# EAGLE design 9-Dof_Sensor_Card (EAGLE 6.4)

## Sheet 1 of 2
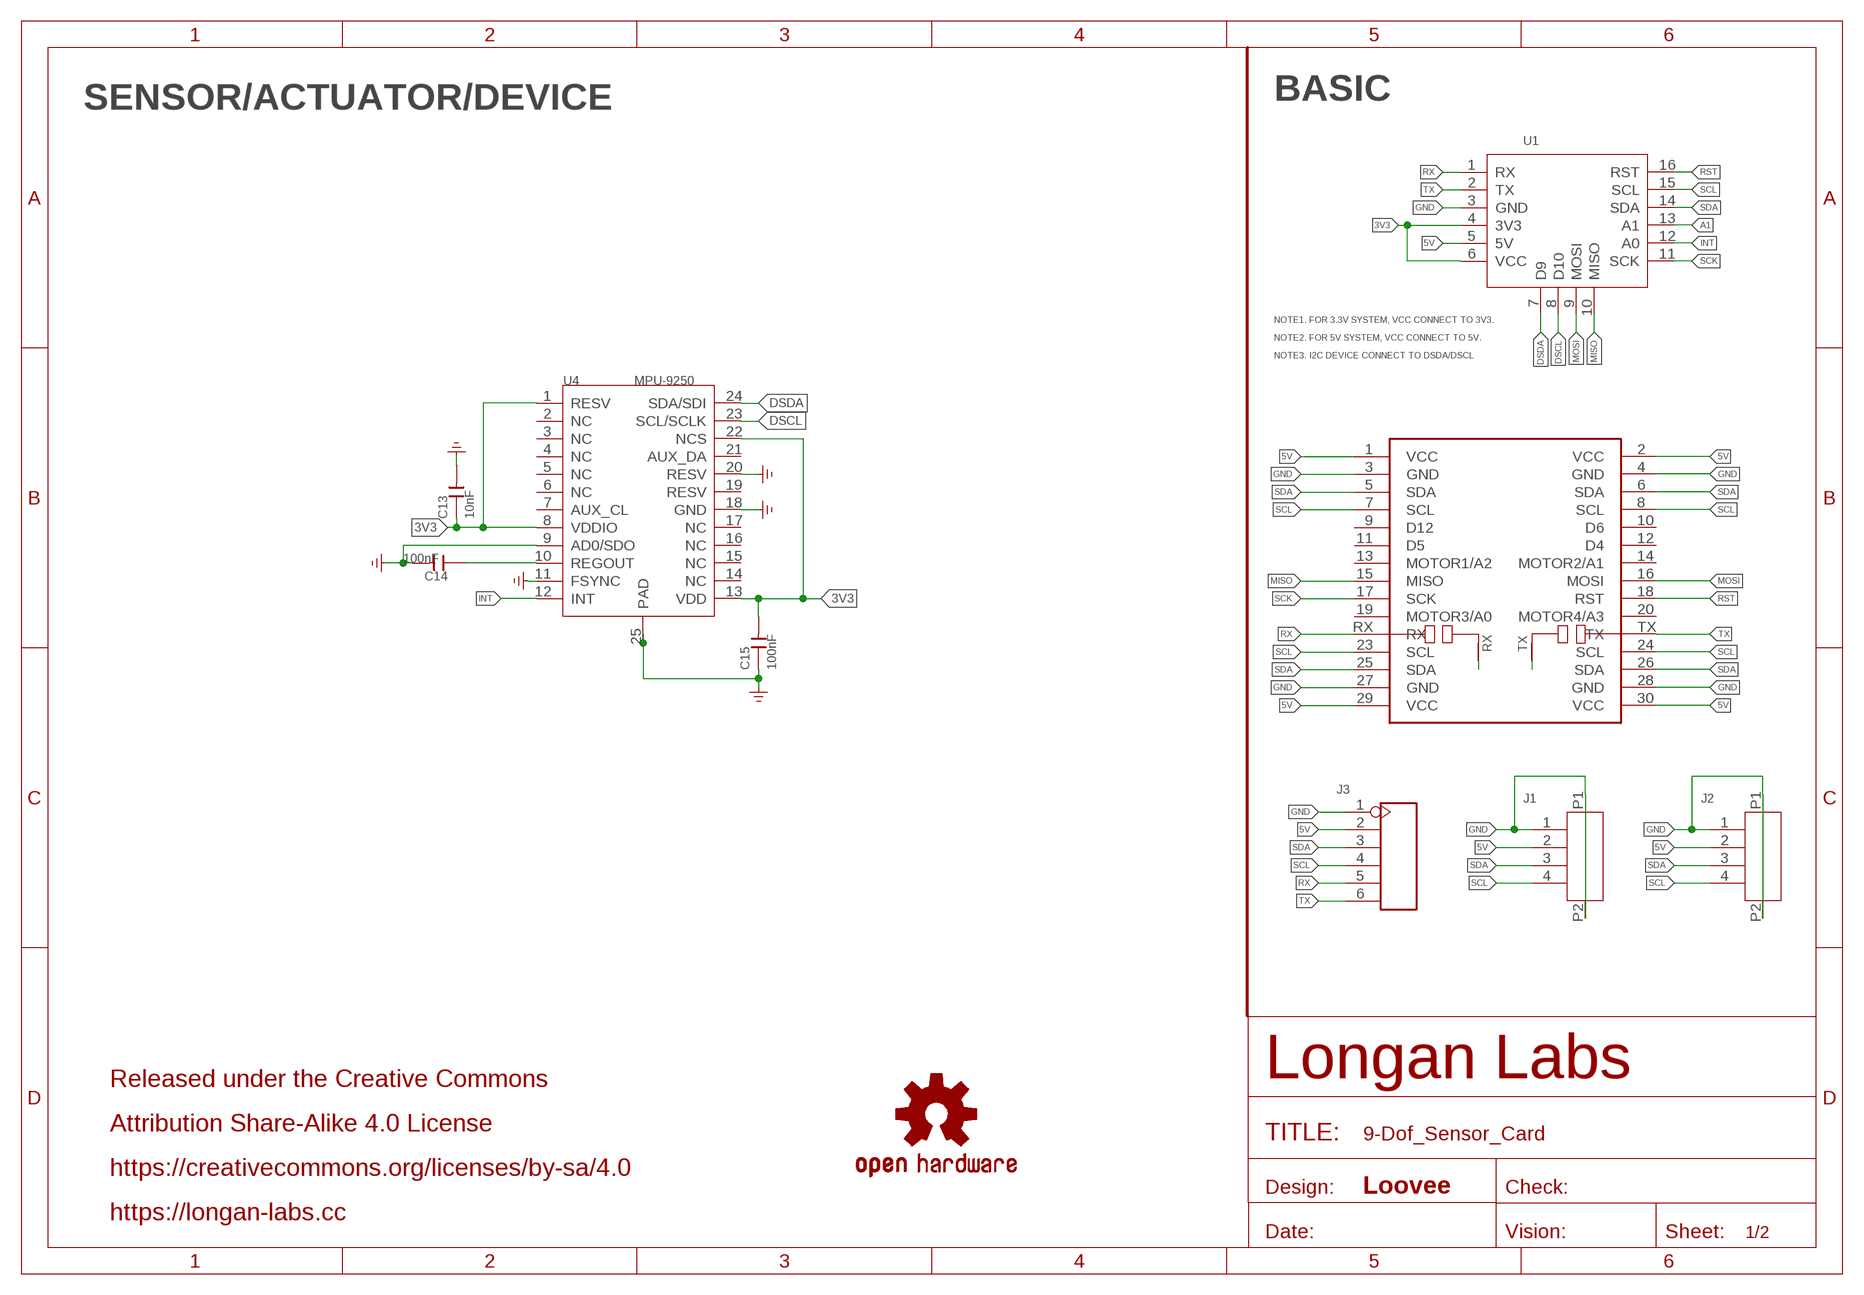
[diagram p0: schematic, sheet 1]

### Parts
C13  10nF  CAP-0603  [C0603]
C14  100nF  CAP-0603  [C0603]
C15  100nF  CAP-0603  [C0603]
J1  HEADER-4P-1.0  [4P-1.0-90D]
J2  HEADER-4P-1.0  [4P-1.0-90D]
J3  HEADER-6P-55/35MIL  [H6-2.54]
LOGO2  OSHW-LOGOS  [OSHW-LOGO-S]
MOUDLE2  MOUDLE-CARDS-UART'BOARD'  [MOUDLE-2X15P-UART]
U1  MOUDLE-CARDS  [16P-2.0-CARDS]
U4  MPU-9250  [LEAD-QFN24]

### Nets
3V3: C13.1 C15.2 U1.4(3V3) U1.6(VCC) U4.1(RESV) U4.8(VDDIO) U4.13(VDD) U4.22(NCS)
5V: J1.2 J2.2 J3.2 MOUDLE2.1(VCC) MOUDLE2.2(VCC) MOUDLE2.29(VCC) MOUDLE2.30(VCC) U1.5(5V)
A1: U1.13(A1)
DSCL: U1.8(D10) U4.23(SCL/SCLK)
DSDA: U1.7(D9) U4.24(SDA/SDI)
GND: C13.2 C14.2 C15.1 J1.1 J1.P1 J1.P2 J2.1 J2.P1 J2.P2 J3.1 MOUDLE2.3(GND) MOUDLE2.4(GND) MOUDLE2.27(GND) MOUDLE2.28(GND) U1.3(GND) U4.9(AD0/SDO) U4.11(FSYNC) U4.18(GND) U4.20(RESV) U4.25(PAD) ; supply symbol labelled GND_POWER
INT: U1.12(A0) U4.12(INT)
MISO: MOUDLE2.15(MISO) U1.10(MISO)
MOSI: MOUDLE2.16(MOSI) U1.9(MOSI)
N$1: C14.1 U4.10(REGOUT)
N$2: MOUDLE2.RX/N1(RX/N) MOUDLE2.RX/N2(RX/N)
N$3: MOUDLE2.TX/N1(TX/N) MOUDLE2.TX/N2(TX/N)
RST: MOUDLE2.18(RST) U1.16(RST)
RX: J3.5 MOUDLE2.RX U1.1(RX)
SCK: MOUDLE2.17(SCK) U1.11(SCK)
SCL: J1.4 J2.4 J3.4 MOUDLE2.7(SCL) MOUDLE2.8(SCL) MOUDLE2.23(SCL) MOUDLE2.24(SCL) U1.15(SCL)
SDA: J1.3 J2.3 J3.3 MOUDLE2.5(SDA) MOUDLE2.6(SDA) MOUDLE2.25(SDA) MOUDLE2.26(SDA) U1.14(SDA)
TX: J3.6 MOUDLE2.TX U1.2(TX)
Unconnected: MOUDLE2.9(D12) MOUDLE2.10(D6) MOUDLE2.11(D5) MOUDLE2.12(D4) MOUDLE2.13(MOTOR1/A2) MOUDLE2.14(MOTOR2/A1) MOUDLE2.19(MOTOR3/A0) MOUDLE2.20(MOTOR4/A3) U4.2(NC) U4.3(NC) U4.4(NC) U4.5(NC) U4.6(NC) U4.7(AUX_CL) U4.14(NC) U4.15(NC) U4.16(NC) U4.17(NC) U4.19(RESV) U4.21(AUX_DA)

### Notes on the sheet
- SENSOR/ACTUATOR/DEVICE | BASIC
- NOTE1. FOR 3.3V SYSTEM, VCC CONNECT TO 3V3.
- NOTE2. FOR 5V SYSTEM, VCC CONNECT TO 5V.
- NOTE3. I2C DEVICE CONNECT TO DSDA/DSCL
- Released under the Creative Commons
- Attribution Share-Alike 4.0 License
- https://creativecommons.org/licenses/by-sa/4.0
- Loovee
- https://longan-labs.cc

## Sheet 2 of 2

## Library data of the parts
C13-C15 = Discrete-new:CAP: Ceramic Capacitors
J1 J2 = Longan-Connect:HEADER-4P-1.0
J3 = Connector-new:HEADER-6P
LOGO2 = SparkFun-Aesthetics:OSHW-LOGO: Open-Source Hardware (OSHW) Logo This logo indicates the piece of hardware it is found on incorporates a OSHW license and/or adheres to the definition of open source hardware found here: http://freedomdefined.org/OSHW
MOUDLE2 = Longan-moudle:MOUDLE-CARDS-UART
U1 = MOUDLE-CARDS:MOUDLE-CARDS
U4 = template:MPU-9250

## Board
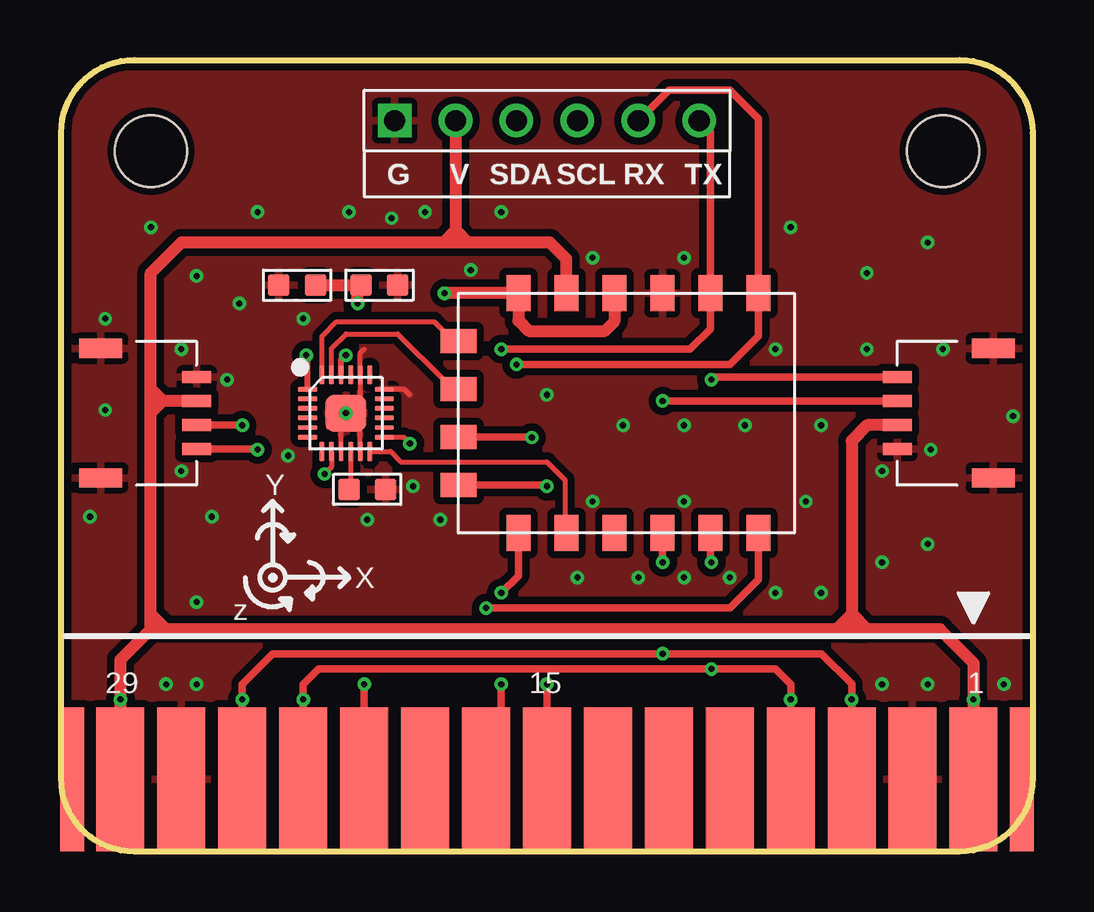
[diagram p1: board, top side]
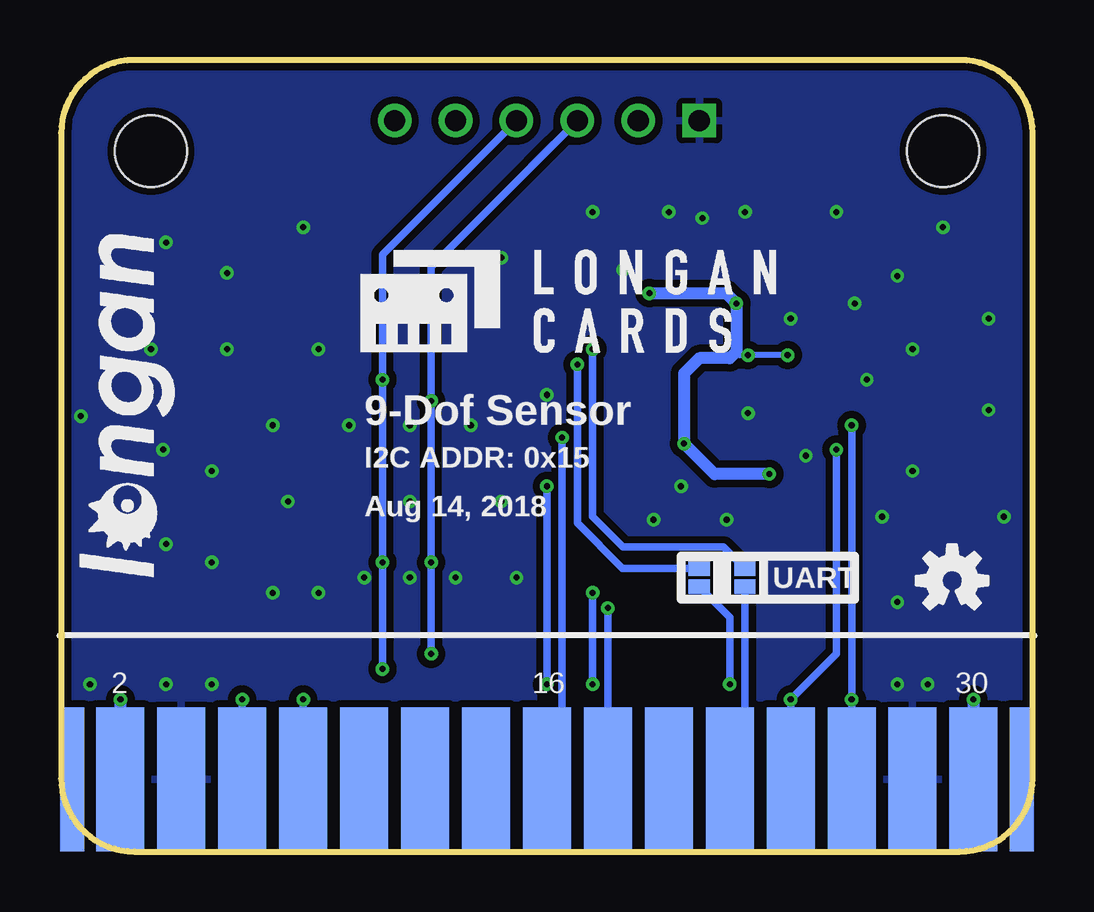
[diagram p2: board, bottom side, seen from below]

Size 40.5 x 33 mm. Coordinates in mm from the lower left corner, seen from the top.
Copper layers (1*16): Top 0.035mm / dielectric 1.5mm / Bottom 0.035mm
Design rules "SeeedStudio_2layer_DRU_no_angle_20140221 *": minimum track width 6mil, minimum drill 10mil, track to track 6mil, track to pad 6mil, pad to pad 6mil, via to via 6mil, smd to smd 0mil, copper to edge 10mil, drill to drill 10mil, minimum pad ring 10mil, minimum via ring 6mil, stop-mask expansion 2mil, vias tented up to drill 25mil, thermal gap 10mil

### Footprints (pad centres in the part's own frame; a part is rotated, then mirrored left to right if it is on the bottom)
C0603 = smd 0.889 x 0.889: 1 0,0.762; 2 0,-0.762
4P-1.0-90D = smd 1.2 x 0.5: 1 0,1.5; 2 0,0.5; 3 0,-0.5; 4 0,-1.5 | smd 1.8 x 0.8: P1 -4,2.7; P2 -4,-2.7
H6-2.54 = drill 0.889 pad 1.397 square: 1 0,6.35 | drill 0.889 pad 1.397: 2 0,3.81; 3 0,1.27; 4 0,-1.27; 5 0,-3.81; 6 0,-6.35
MOUDLE-2X15P-UART = smd 2 x 6: 1 17.78,-13.492; 3 15.24,-13.492; 5 12.7,-13.492; 7 10.16,-13.492; 9 7.62,-13.492; 11 5.08,-13.492; 13 2.54,-13.492; 15 0,-13.492; 17 -2.54,-13.492; 19 -5.08,-13.492; 23 -10.16,-13.492; 25 -12.7,-13.492; 27 -15.24,-13.492; 29 -17.78,-13.492; RX/N2 -7.62,-13.492 | smd 2 x 6 bottom: 2 17.78,-13.492; 4 15.24,-13.492; 6 12.7,-13.492; 8 10.16,-13.492; 10 7.62,-13.492; 12 5.08,-13.492; 14 2.54,-13.492; 16 0,-13.492; 18 -2.54,-13.492; 20 -5.08,-13.492; 24 -10.16,-13.492; 26 -12.7,-13.492; 28 -15.24,-13.492; 30 -17.78,-13.492; TX/N2 -7.62,-13.492 | smd 1 x 6: P1 -19.8,-13.492; P4 19.8,-13.492 | smd 1 x 6 bottom: P2 -19.8,-13.492; P3 19.8,-13.492 | smd 0.889 x 0.61 bottom: RX -6.35,-4.699; RX/N1 -6.35,-5.461; TX -8.255,-4.699; TX/N1 -8.255,-5.461 | hole 3: -16.51,12.7; 16.51,12.7
16P-2.0-CARDS = smd 1.5 x 1: 1 -5,5; 2 -5,3; 3 -5,1; 4 -5,-1; 5 -5,-3; 6 -5,-5; 11 5,-5; 12 5,-3; 13 5,-1; 14 5,1; 15 5,3; 16 5,5 | smd 1 x 1.5: 7 -3,-7.5; 8 -1,-7.5; 9 1,-7.5; 10 3,-7.5
LEAD-QFN24 = smd 0.8 x 0.2: 1 -1.6,1; 2 -1.6,0.6; 3 -1.6,0.2; 4 -1.6,-0.2; 5 -1.6,-0.6; 6 -1.6,-1; 13 1.6,-1; 14 1.6,-0.6; 15 1.6,-0.2; 16 1.6,0.2; 17 1.6,0.6; 18 1.6,1 | smd 0.2 x 0.8: 7 -1,-1.6; 8 -0.6,-1.6; 9 -0.2,-1.6; 10 0.2,-1.6; 11 0.6,-1.6; 12 1,-1.6; 19 1,1.6; 20 0.6,1.6; 21 0.2,1.6; 22 -0.2,1.6; 23 -0.6,1.6; 24 -1,1.6 | smd 1.7 x 1.54: 25 0,0

### Placement (x,y rotation side)
C13  13.27,23.61 90 top
C14  12.76,15.1 90 top
C15  9.84,23.61 90 top
J1  5.64,18.28 0 top
J2  34.86,18.28 180 top
J3  20.25,30.47 90 top
LOGO2  3.36,11.29 0 bottom
MOUDLE2  20.25,16.5 0 top
U1  24.06,18.28 270 top
U4  11.87,18.28 0 top
U$1  [LONGAN-CARDS-MIDDLE]  28.76,20.31 0 bottom
U$2  [LONGAN-SILK-SMALLER]  34.6,10.15 90 bottom

### Tracks (layer width: path | path; a pad name or v marks a point on that pad's centre or on a via)
3V3  (via drill 0.25 pad 0.51)
  Top 0.203: U4.13 14.27,17.28 v14.54,17.01 | U4.8 11.27,16.03 v10.98,15.74
  Top 0.254: U4.22 11.67,20.49 v11.87,20.69 | U4.1 10.27,20.64 v10.22,20.69
  Top 0.508: U1.4 23.06,22.1 22.66,21.71 19.49,21.71 19.06,22.13 U1.6 v15.98,23.28 | C15.2 C13.1 12.36,23.47 v12.36,22.85
  Bottom 0.254: 12.36,20.83 12.22,20.69 v11.87,20.69 v10.22,20.69
  Bottom 0.508: v15.98,23.28 12.79,23.28 v12.36,22.85 12.36,20.83 12.63,20.56 13.9,20.56 14.54,19.93 v14.54,17.01 13.27,15.74 v10.98,15.74
5V  (via drill 0.25 pad 0.51)
  Top 0.508: 33.59,9.26 36.63,9.26 38.03,7.86 v38.03,6.34 MOUDLE2.2 | 32.82,9.26 32.31,9.26 | 32.31,9.26 4.38,9.26 | 4.38,9.26 3.74,9.26 | 3.74,9.26 2.47,7.99 v2.47,6.34 MOUDLE2.30 | 3.74,9.26 3.74,9.9 | 3.74,9.9 3.74,18.28 | 3.74,18.28 3.74,18.79 | J1.2 4.26,18.78 | 4.24,18.78 3.75,18.78 3.74,18.79 | U1.5 21.06,24.71 20.38,25.39 16.95,25.39 | 16.95,25.39 16.44,25.39 | 16.44,25.39 15.93,25.39 | 15.93,25.39 5.01,25.39 3.74,24.12 3.74,19.29 | 3.74,18.79 3.74,19.29 | J3.2 16.44,25.9 | 16.44,25.9 16.44,25.39 | J2.2 33.59,17.78 32.95,17.14 32.95,9.9 | 32.95,9.9 32.95,9.39 32.82,9.26 | 4.26,18.78 3.74,19.29 | 4.26,18.78 4.24,18.78 | 4.24,18.78 3.74,18.28 | 16.44,25.9 16.95,25.39 | 16.44,25.9 15.93,25.39 | 32.95,9.9 33.59,9.26 | 32.95,9.9 32.31,9.26 | 32.82,9.26 33.59,9.26 | 4.38,9.26 3.74,9.9
  Bottom 0.508: v2.47,6.34 MOUDLE2.30 | v38.03,6.34 MOUDLE2.2
DSCL
  Top 0.203: U4.23 11.27,20.98 11.87,21.58 14.03,21.58 15.93,19.68 16.16,19.68 U1.8
DSDA
  Top 0.203: U4.24 10.87,21.47 11.49,22.09 15.55,22.09 16.06,21.58 16.26,21.58 U1.7
GND  (via drill 0.25 pad 0.51)
  Top 0.203: 11.14,17.68 11.23,17.77 11.23,18.15 | U4.9 11.67,18.08 U4.25 | U4.11 12.47,17.68 U4.25 | 12.47,18.88 U4.25 | U4.18 14.3,19.28 14.54,19.04 | 12.63,20.95 12.47,20.78 U4.20 12.47,18.19 12.5,18.15
  other vias: 4.38,6.97 5.64,6.97 34.22,6.97 36.12,6.97 21.52,11.42 24.06,11.42 25.96,11.42 27.87,11.42 29.77,10.79 31.68,10.79 39.68,18.15 36.25,16.75 36.76,20.95 31.68,17.77 28.51,17.77 25.96,17.77 23.43,17.77 25.96,14.6 22.16,14.6 31.05,14.6 20.25,19.04 17.07,24.25 5.01,20.95 5.01,15.87 1.84,18.41 1.84,22.21 1.2,13.96 6.28,13.96 5.64,23.99 3.74,26.02 8.19,26.66 15.17,26.66 11.99,26.66 18.34,26.66 22.16,24.76 25.96,24.76 29.77,20.95 33.59,20.95 30.41,26.02 36.12,25.39 33.59,24.12 34.22,12.05 36.12,12.82 34.22,15.87 39.3,6.97 12.76,13.83 5.64,10.4 13.77,26.41 7.42,22.85 11.87,18.28 15.8,13.83 6.91,19.68 9.46,16.5 14.66,15.23 10.09,22.21
  pour Bottom (isolate 0.305): -0.07,33.01 40.57,33.01 40.57,-0.01 -0.07,-0.01
  pour Top (isolate 0.305): -0.07,33.01 40.57,33.01 40.57,-0.01 -0.07,-0.01
INT
  Top 0.203: U4.12 13.72,16.68 14.15,16.25 20.25,16.25 21.01,15.48 21.01,13.33 U1.12
MISO  (via drill 0.25 pad 0.51)
  Top 0.305: U1.10 20.2,15.28 v20.25,15.23 | v20.25,6.97 MOUDLE2.15
  Bottom 0.305: v20.25,15.23 v20.25,6.97
MOSI  (via drill 0.25 pad 0.51)
  Top 0.305: U1.9 19.6,17.28 v19.61,17.26
  Bottom 0.305: v19.61,17.26 19.61,3.64 MOUDLE2.16
N$1
  Top 0.203: U4.10 12.07,15.18
  Top 0.305: 12.07,15.18 C14.1
N$2  (via drill 0.25 pad 0.51)
  Top 0.305: MOUDLE2.RX/N2 v12.63,6.97
  Bottom 0.305: v12.63,6.97 12.63,9.77 MOUDLE2.RX/N1
N$3
  Bottom 0.305: MOUDLE2.TX/N1 11.99,3.64 MOUDLE2.TX/N2
RST  (via drill 0.25 pad 0.51)
  Top 0.305: U1.16 29.06,11.34 27.87,10.15 v17.71,10.15
  Bottom 0.305: v17.71,10.15 17.71,3.93 17.96,3.67 17.96,2.78 17.58,2.4 17.58,2.88 MOUDLE2.18
RX  (via drill 0.25 pad 0.51)
  Top 0.305: J3.5 25.33,31.74 27.87,31.74 29.06,30.55 U1.1 29.06,21.5 27.87,20.31 v18.98,20.31
  Bottom 0.305: MOUDLE2.RX 17.09,11.8 18.98,13.69 v18.98,20.31
SCK  (via drill 0.25 pad 0.51)
  Top 0.305: U1.11 19.06,11.5 v18.34,10.79 | v18.34,6.97 18.34,3.64 MOUDLE2.17
  Bottom 0.305: v18.34,10.79 v18.34,6.97
SCL  (via drill 0.25 pad 0.51)
  Top 0.305: U1.15 27.06,12.1 v27.11,12.05 | J1.4 8.16,16.78 v8.19,16.75 | J2.4 27.21,19.78 v27.11,19.68 | MOUDLE2.23 v10.09,6.34 10.09,6.97 10.72,7.61 v27.11,7.61 29.77,7.61 30.41,6.97 v30.41,6.34 MOUDLE2.8 | MOUDLE2.23 10.09,2.53 10.22,2.4 10.22,2.88 MOUDLE2.23
  Bottom 0.305: v27.11,7.61 v27.11,12.05 v27.11,19.68 27.11,24.88 J3.4 | v8.19,16.75 8.19,8.24 v10.09,6.34 MOUDLE2.23 | v30.41,6.34 MOUDLE2.8
SDA  (via drill 0.25 pad 0.51)
  Top 0.305: U1.14 25.06,12.07 v25.08,12.05 | J1.3 v7.54,17.78 v7.55,17.77 | J2.3 25.08,18.78 v25.08,18.79 | MOUDLE2.25 7.42,3.13 7.42,3.55 7.55,3.67 v7.55,6.34 7.55,6.97 8.82,8.24 v25.08,8.24 31.69,8.24 32.95,6.99 v32.95,6.34 MOUDLE2.6
  Bottom 0.305: v25.08,8.24 v25.08,12.05 v25.08,18.79 25.08,24.37 J3.3 20.89,28.56 | v7.55,17.77 v7.55,6.34 MOUDLE2.25 | v32.95,6.34 MOUDLE2.6
TX  (via drill 0.25 pad 0.51)
  Top 0.305: J3.6 27.06,30.01 U1.2 27.06,21.79 26.22,20.95 v18.34,20.95
  Bottom 0.305: v18.34,20.95 18.34,13.96 17.07,12.69 12.88,12.69 MOUDLE2.TX

### Text on the board
tPlace: G | V | SDA | SCL | RX | TX | Y | X | z
bPlace: 9-Dof Sensor | I2C ADDR: 0x15 | Aug 14, 2018